# Altium schematic sheet MCU_SIGNAL.SchDoc
size A; SheetNumber: 1; SheetTotal: 4
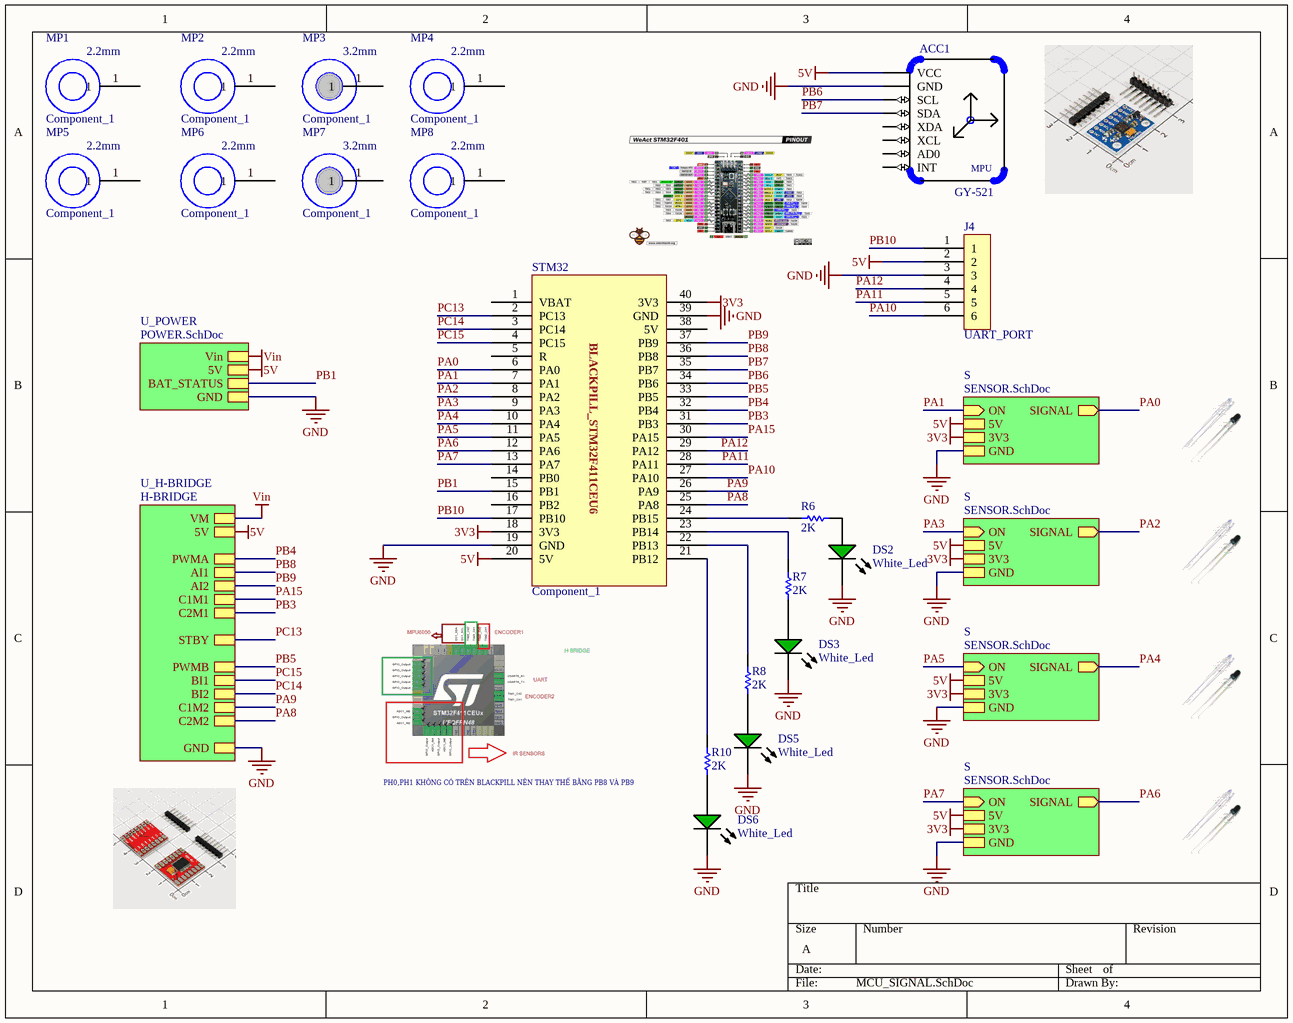
[diagram p0: MCU_SIGNAL.SchDoc]

## Parts
ACC1  GY-521  [*GY-521_GY-521(Primary)]
DS2  White_Led  [AVAG-HSMX-C170_V]
DS3  White_Led  [AVAG-HSMX-C170_V]
DS5  White_Led  [AVAG-HSMX-C170_V]
DS6  White_Led  [AVAG-HSMX-C170_V]
J4  UART_PORT  [HDR Female 1~6 2.54mm]
MP1  Component_1  [PCBComponent_1]
MP2  Component_1  [PCBComponent_1]
MP3  Component_1  [PCBComponent_1]
MP4  Component_1  [PCBComponent_1]
MP5  Component_1  [PCBComponent_1]
MP6  Component_1  [PCBComponent_1]
MP7  Component_1  [PCBComponent_1]
MP8  Component_1  [PCBComponent_1]
R6  2K  [RESC2013X60X35ML10T20]
R7  2K  [RESC2013X60X35ML10T20]
R8  2K  [RESC2013X60X35ML10T20]
R10  2K  [RESC2013X60X35ML10T20]
STM32  Component_1  [MODULE_ZC323000]

## Sub-sheets
S = SENSOR.SchDoc: ON (in), SIGNAL (out), 5V, GND, 3V3
S = SENSOR.SchDoc: ON (in), SIGNAL (out), 5V, GND, 3V3
S = SENSOR.SchDoc: ON (in), SIGNAL (out), 5V, GND, 3V3
S = SENSOR.SchDoc: ON (in), SIGNAL (out), 5V, GND, 3V3
U_H-BRIDGE = H-BRIDGE: VM, 5V, PWMA, AI1, AI2, STBY, BI1, BI2, PWMB, GND, C1M1, C2M1, C1M2, C2M2
U_POWER = POWER.SchDoc: 5V, GND, Vin, BAT_STATUS

## Nets
3V3: STM32.18(3V3) STM32.40(3V3) ; sheet S/3V3, sheet S/3V3, sheet S/3V3, sheet S/3V3
5V: ACC1.VCC J4.2 STM32.20(5V) ; sheet U_H-BRIDGE/5V, sheet S/5V, sheet S/5V, sheet S/5V, sheet S/5V, sheet U_POWER/5V
GND: ACC1.GND DS2.2(K) DS3.2(K) DS5.2(K) DS6.2(K) J4.3 STM32.19(GND) STM32.39(GND) ; sheet U_H-BRIDGE/GND, sheet S/GND, sheet S/GND, sheet S/GND, sheet S/GND, sheet U_POWER/GND
Vin: sheet U_H-BRIDGE/VM, sheet U_POWER/Vin
PA0: STM32.6(PA0) ; sheet S/SIGNAL
PA1: STM32.7(PA1) ; sheet S/ON
PA2: STM32.8(PA2) ; sheet S/SIGNAL
PA3: STM32.9(PA3) ; sheet S/ON
PA4: STM32.10(PA4) ; sheet S/SIGNAL
PA5: STM32.11(PA5) ; sheet S/ON
PA6: STM32.12(PA6) ; sheet S/SIGNAL
PA7: STM32.13(PA7) ; sheet S/ON
PA8: STM32.25(PA8) ; sheet U_H-BRIDGE/C2M2
PA9: STM32.26(PA9) ; sheet U_H-BRIDGE/C1M2
PA10: J4.6 STM32.27(PA10)
PA11: J4.5 STM32.28(PA11)
PA12: J4.4 STM32.29(PA12)
PA15: STM32.30(PA15) ; sheet U_H-BRIDGE/C1M1
PB1: STM32.15(PB1) ; sheet U_POWER/BAT_STATUS
PB3: STM32.31(PB3) ; sheet U_H-BRIDGE/C2M1
PB4: STM32.32(PB4) ; sheet U_H-BRIDGE/PWMA
PB5: STM32.33(PB5) ; sheet U_H-BRIDGE/PWMB
PB6: ACC1.SCL STM32.34(PB6)
PB7: ACC1.SDA STM32.35(PB7)
PB8: STM32.36(PB8) ; sheet U_H-BRIDGE/AI1
PB9: STM32.37(PB9) ; sheet U_H-BRIDGE/AI2
PB10: J4.1 STM32.17(PB10)
PC13: STM32.2(PC13) ; sheet U_H-BRIDGE/STBY
PC14: STM32.3(PC14) ; sheet U_H-BRIDGE/BI2
PC15: STM32.4(PC15) ; sheet U_H-BRIDGE/BI1
NetDS2_1: DS2.1(A) R6.2
NetDS3_1: DS3.1(A) R7.1
NetDS5_1: DS5.1(A) R8.1
NetDS6_1: DS6.1(A) R10.1
NetR6_1: R6.1 STM32.24(PB15)
NetR7_2: R7.2 STM32.23(PB14)
NetR8_2: R8.2 STM32.22(PB13)
NetR10_2: R10.2 STM32.21(PB12)

Not connected (* = marked no-connect by the designer): ACC1 AD0 INT XCL XDA; MP1 1; MP2 1; MP3 1; MP4 1; MP5 1; MP6 1; MP7 1; MP8 1; STM32 1(VBAT) 5(R) 14(PB0) 16(PB2) 38(5V)

## Notes on the sheet
- PH0,PH1 KHÔNG CÓ TRÊN BLACKPILL NÊN THAY THẾ BẰNG PB8 VÀ PB9
- (in symbol Component_1) BLACKPILL_STM32F411CEU6; 2.2mm; 3.2mm
- (in symbol GY-521) MPU

## Library data of the parts
ACC1 = GY-521: Triple Axis Accelerometer Gyro Breakout; MF: GODREAM FORDREAM CO., LIMITED; SnapEDA_Link: https://www.snapeda.com/parts/GY-521/GODREAM+FORDREAM+CO.%252C+LIMITED/view-part/?ref=snap; Package: Package; MP: GY-521; Check_prices: https://www.snapeda.com/parts/GY-521/GODREAM+FORDREAM+CO.%252C+LIMITED/view-part/?ref=eda; Value: *
DS2 DS3 DS5 DS6 = CMP-2000-05062-1: Chip LED, Green, 2.2 V, -40 to 85 degC, 2-Pin SMD, Pb-Free, Tape and Reel; Manufacturer: Avago; No. of Pins: 2; Peak Wavelength: 570nm; SVHC: NoSVHC(16-Jun-2014); Dominant Wavelength: 572nm; Forward Current If: 20mA; Viewing Angle: 170deg; Lens Shape: Rectangular; PIV Max: 5V; External Width: 1.25mm; LED Type: Standard; External Depth: 0.8mm; Opto Mounting Orientation: Top; Luminous Intensity: 15mcd; Luminous Intensity Min: 4mcd; Forward Voltage VF Max: 2.6V; External Length / Height: 2mm; Bulb Size: 1.25mmx1.4mm; Light Area Height: 1mm; Voltage Vf Typ: 2.2V; Operating Temperature Max: 85degC; Datasheet Version: Oct-08; MSL: MSL2A-4weeks; Peak Forward Current: 20mA; Package Description: 2-Pin Surface Mount Device, Body 2 x 1.25 mm, Height 0.8 mm; Datasheet URL: https://datasheet.ciiva.com/29280/180495-da-01-en-chip-led-hsmg-c170-gelb-gruen-29280971.pdf; Storage Temperature Min: -40degC; LED Colour: Green; Wavelength Typ: 570nm; Mounting Type: SMD; Forward Current If Max: 20mA; Dominant Wavelength Typ: 572nm; LED Mounting: SMD; Operating Temperature Range: -30degCto+85degC; Operating Temperature Min: -30degC; Manufacturer URL: http://www.avagotech.com/; Packaging: CutTape; Luminous Intensity Typ: 15mcd; Package Reference: HSMX-C170; Storage Temperature Max: 85degC; Opto Case Style: SMD; Forward Voltage: 2.2V
J4 = M20-7820646: 06-WAY SIL VERT SOCKET L/FREE; Manufacturer: Harwin; Number of Contacts: 6; Gender: Female; Connector Type: Receptacle,Socket; Max Current Rating: 3A; Contact Resistance: 20mR; Pitch: 2.54mm; Manufacturer Part Number: M20-7820646; RoHS: Yes; Category: Headers and Wire Housings; Stock 1: 1563; Pricing 1: 1=0,96000, 10=0,84200, 100=0,72600, 500=0,59400, 1000=0,52800, 5000=0,46200, 10000=0,43890 (USD); Mount: Through Hole; Case/Package: SIL; Housing Material: Nylon; Color: Black; Contact Plating: Tin; Contact Material: Bronze; Housing Color: Black; Min Operating Temperature: -40°C; Max Operating Temperature: 105°C; Termination: Solder; Number of Rows: 1; Number of Positions: 6; Packaging: Rail/Tube; Orientation: Straight; Contact Gender: Female; Package Quantity: 38; Length: 15.64mm; Depth: 2.5mm; Radiation Hardening: No; ComponentLink1URL: http://components.arrow.com/part/dataview/0323_00725884?src-supplier=Arrow+Europe; ComponentLink1Description: http://components.arrow.com/part/dataview/0323_00725884?src-supplier=Arrow+Europe; ComponentLink2URL: http://www.harwin.com/include/downloads/pdfs/2010PAGE120.PDF?src-supplier=Avnet; ComponentLink2Description: http://www.harwin.com/include/downloads/pdfs/2010PAGE120.PDF?src-supplier=Avnet; ComponentLink3URL: https://cdn.harwin.com/pdfs/M20-782.pdf?src-supplier=Digi-Key; ComponentLink3Description: https://cdn.harwin.com/pdfs/M20-782.pdf?src-supplier=Digi-Key; ComponentLink4URL: https://cdn.harwin.com/pdfs/Harwin_PC_Connectors_M20.pdf?src-supplier=Avnet+Europe; ComponentLink4Description: https://cdn.harwin.com/pdfs/Harwin_PC_Connectors_M20.pdf?src-supplier=Avnet+Europe; ComponentLink5URL: https://cdn.harwin.com/pdfs/Harwin_PC_Connectors_M20.pdf?src-supplier=RSComponents; ComponentLink5Description: https://cdn.harwin.com/pdfs/Harwin_PC_Connectors_M20.pdf?src-supplier=RSComponents; ComponentLink6URL: https://cdn.harwin.com/pdfs/Harwin_PC_Connectors_M20.pdf?src-supplier=Mouser; ComponentLink6Description: https://cdn.harwin.com/pdfs/Harwin_PC_Connectors_M20.pdf?src-supplier=Mouser; ComponentLink7URL: https://cdn.harwin.com/pdfs/Harwin_PC_Connectors_M20.pdf?src-supplier=TTI; ComponentLink7Description: https://cdn.harwin.com/pdfs/Harwin_PC_Connectors_M20.pdf?src-supplier=TTI; Supplier 1: Digi-Key; Supplier Part Number 1: 952-1809-ND
R6-R8 R10 = CMP-2100-03671-1: Chip Resistor, 1 KOhm, +/- 1%, 125 mW, -55 to 155 degC, 0805 (2012 Metric), RoHS, Tape and Reel; Manufacturer: Yageo; Temperature Coefficient: 100ppm/degreesC; Voltage Rating (DC): 150V; Max Power Dissipation: 125mW; Resistance: 1KOhm; Number of Pins: 2; Number of Terminations: 2; Datasheet URL: http://www.yageo.com/NewPortal/yageodocoutput?fileName=/pdf/R-Chip/PYu-RC_Group_51_RoHS_L_5.pdf; Length: 0.079inch; Package Description: 2-Pin Surface Mounted Device, Body 2 x 1.25 mm; Depth: 1.25mm; Height: 0.024inch; Military Standard: Not; Case/Package: 0805; Package Reference: 0805; RoHSCompliant: true; Lead Free: LeadFree; Packaging: TapeandReel; Package Quantity: 1; Datasheet Version: Rev. 5, 10/2016; Tolerance: 1%; Min Operating Temperature: -55degC; Voltage Rating: 150V; Composition: ThickFilm; Case Code (Imperial): 0805; Power Rating: 125mW; Width: 0.049inch; Case Code (Metric): 2012; Manufacturer URL: http://www.yageo.com/; Max Operating Temperature: 155degC; REACH SVHC: Unknown; Termination: SMD/SMT